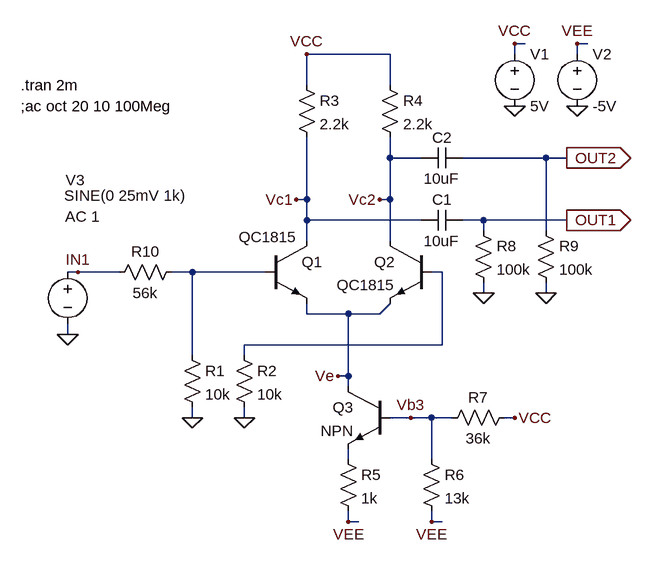
[diagram p0: schematic Diff_Amp_2SC1815_In_1ch.asc]
Diff_Amp_2SC1815_In_1ch.asc, the LTspice schematic file:
Version 4
SHEET 1 880 680
WIRE 512 -192 496 -192
WIRE 608 -192 592 -192
WIRE 304 -176 176 -176
WIRE 496 -176 496 -192
WIRE 592 -176 592 -192
WIRE 176 -128 176 -176
WIRE 304 -128 304 -176
WIRE 304 -16 304 -48
WIRE 352 -16 304 -16
WIRE 544 -16 416 -16
WIRE 576 -16 544 -16
WIRE 176 48 176 -48
WIRE 176 48 160 48
WIRE 304 48 304 -16
WIRE 304 48 288 48
WIRE 176 80 176 48
WIRE 352 80 176 80
WIRE 448 80 416 80
WIRE 576 80 448 80
WIRE 448 96 448 80
WIRE 544 96 544 -16
WIRE 176 112 176 80
WIRE 304 112 304 48
WIRE -176 160 -192 160
WIRE -112 160 -176 160
WIRE 0 160 -32 160
WIRE 112 160 0 160
WIRE 384 160 368 160
WIRE 448 192 448 176
WIRE 544 192 544 176
WIRE 176 224 176 208
WIRE 240 224 176 224
WIRE 288 224 304 208
WIRE 288 224 240 224
WIRE -192 256 -192 240
WIRE 384 272 384 160
WIRE 384 272 80 272
WIRE 0 288 0 160
WIRE 80 288 80 272
WIRE 240 320 240 224
WIRE 240 320 224 320
WIRE 240 336 240 320
WIRE 0 384 0 368
WIRE 80 384 80 368
WIRE 336 384 304 384
WIRE 368 384 336 384
WIRE 400 384 368 384
WIRE 496 384 480 384
WIRE 240 448 240 432
WIRE 368 448 368 384
WIRE 240 544 240 528
WIRE 256 544 240 544
WIRE 368 544 368 528
WIRE 384 544 368 544
FLAG 0 384 0
FLAG 80 384 0
FLAG 496 384 VCC
FLAG 176 -176 VCC
FLAG 240 544 VEE
FLAG 368 544 VEE
FLAG 448 192 0
FLAG 544 192 0
FLAG 576 80 OUT1
IOPIN 576 80 Out
FLAG 576 -16 OUT2
IOPIN 576 -16 Out
FLAG 496 -96 0
FLAG 592 -96 0
FLAG 496 -192 VCC
FLAG 592 -192 VEE
FLAG -176 160 IN1
FLAG 336 384 Vb3
FLAG 224 320 Ve
FLAG 160 48 Vc1
FLAG 288 48 Vc2
FLAG -192 256 0
SYMBOL npn 112 112 R0
WINDOW 3 -41 -6 Left 2
SYMATTR Value QC1815
SYMATTR InstName Q1
SYMBOL npn 368 112 M0
SYMATTR InstName Q2
SYMATTR Value QC1815
SYMBOL npn 304 336 M0
SYMATTR InstName Q3
SYMBOL res -16 272 R0
SYMATTR InstName R1
SYMATTR Value 10k
SYMBOL res 64 272 R0
SYMATTR InstName R2
SYMATTR Value 10k
SYMBOL res 160 -144 R0
SYMATTR InstName R3
SYMATTR Value 2.2k
SYMBOL res 288 -144 R0
SYMATTR InstName R4
SYMATTR Value 2.2k
SYMBOL cap 416 64 R90
WINDOW 0 0 32 VBottom 2
WINDOW 3 32 32 VTop 2
SYMATTR InstName C1
SYMATTR Value 10uF
SYMBOL cap 416 -32 R90
WINDOW 0 0 32 VBottom 2
WINDOW 3 32 32 VTop 2
SYMATTR InstName C2
SYMATTR Value 10uF
SYMBOL res 224 432 R0
SYMATTR InstName R5
SYMATTR Value 1k
SYMBOL res 352 432 R0
SYMATTR InstName R6
SYMATTR Value 13k
SYMBOL res 496 368 R90
WINDOW 0 0 56 VBottom 2
WINDOW 3 32 56 VTop 2
SYMATTR InstName R7
SYMATTR Value 36k
SYMBOL res 432 80 R0
SYMATTR InstName R8
SYMATTR Value 100k
SYMBOL res 528 80 R0
SYMATTR InstName R9
SYMATTR Value 100k
SYMBOL voltage 496 -192 R0
WINDOW 123 0 0 Left 2
WINDOW 39 0 0 Left 2
SYMATTR InstName V1
SYMATTR Value 5V
SYMBOL voltage 592 -192 R0
WINDOW 123 0 0 Left 2
WINDOW 39 0 0 Left 2
SYMATTR InstName V2
SYMATTR Value -5V
SYMBOL voltage -192 144 R0
WINDOW 0 -3 -126 Left 2
WINDOW 3 -5 -102 Left 2
WINDOW 123 -4 -70 Left 2
WINDOW 39 0 0 Left 2
SYMATTR InstName V3
SYMATTR Value SINE(0 25mV 1k)
SYMATTR Value2 AC 1
SYMBOL res -16 144 R90
WINDOW 0 0 56 VBottom 2
WINDOW 3 32 56 VTop 2
SYMATTR InstName R10
SYMATTR Value 56k
TEXT -264 -128 Left 2 !.tran 2m
TEXT -264 -96 Left 2 !;ac oct 20 10 100Meg

The netlist it stands for:
* Diff_Amp_2SC1815_In_1ch.asc
Q1 Vc1 N001 Ve 0 QC1815
Q2 Vc2 N002 Ve 0 QC1815
Q3 Ve Vb3 N003 0 NPN
R1 N001 0 10k
R2 N002 0 10k
R3 VCC Vc1 2.2k
R4 VCC Vc2 2.2k
C1 OUT1 Vc1 10uF
C2 OUT2 Vc2 10uF
R5 N003 VEE 1k
R6 Vb3 VEE 13k
R7 VCC Vb3 36k
R8 OUT1 0 100k
R9 OUT2 0 100k
V1 VCC 0 5V
V2 VEE 0 -5V
V3 IN1 0 SINE(0 25mV 1k) AC 1
R10 N001 IN1 56k
.model NPN NPN
.model PNP PNP
.lib standard.bjt
.tran 2m
;ac oct 20 10 100Meg
.backanno
.end